# EAGLE design LDR-4 (EAGLE 7.2.0)
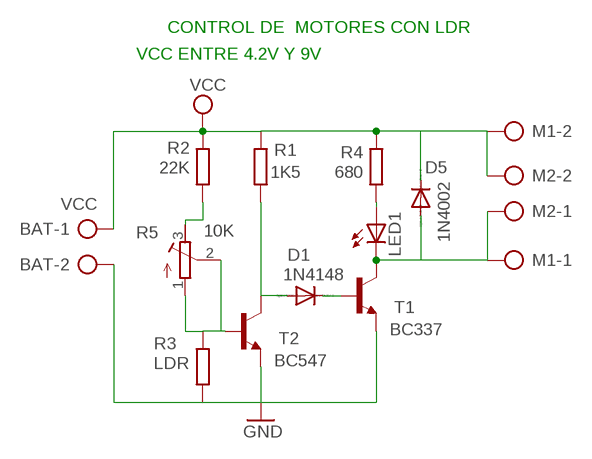
[diagram p0: schematic, sheet 1]

## Parts
BAT  VCC  AK500/2  [AK500/2]
D1  1N4148  1N4148DO35-7  [DO35-7]
D5  1N4002  1N4933  [DO41-10]
LED1  LED3MM  [LED3MM]
M1  AK500/2  [AK500/2]
M2  AK500/2  [AK500/2]
R1  1K5  R-EU_0207/7  [0207/7]
R2  22K  R-EU_0207/7  [0207/7]
R3  LDR  R-EU_0204/5  [0204/5]
R4  680  R-EU_0207/7  [0207/7]
R5  10K  R-TRIMM64W  [RTRIM64W]
T1  BC337  BC337-25-NPN-TO92-CBE  [TO92-CBE]
T2  BC547  BC547-NPN-TO92-CBE  [TO92-CBE]

## Nets
GND: BAT.2 R3.1 T1.E T2.E
N$1: D1.C T1.B
N$2: D1.A R1.1 T2.C
N$3: D5.A LED1.K(C) M1.1 M2.1 T1.C
N$4: R2.1 R5.3(E)
N$5: LED1.A R4.1
N$6: R3.2 R5.1(A) R5.2(S) T2.B
VCC: BAT.1 D5.C M1.2 M2.2 R1.2 R2.2 R4.2

## Notes on the sheet
- CONTROL DE  MOTORES CON LDR
- VCC ENTRE 4.2V Y 9V

## Library data of the parts
BAT M1 M2 = con-ptr500:AK500/2: CONNECTOR; OC_FARNELL: unknown; OC_NEWARK: unknown
D1 = diode:1N4148: DIODE high speed (Philips)
D5 = diode:1N4933: DIODE fast recovery rectifier, 1A
LED1 = led:LED: LED OSRAM: - CHIPLED LG R971, LG N971, LY N971, LG Q971, LY Q971, LO R971, LY R971 LH N974, LH R974 LS Q976, LO Q976, LY Q976 LO Q996 - Hyper CHIPLED LW Q18S LB Q993, LB Q99A, LB R99A - SideLED LS A670, LO A670, LY A670, LG A670, LP A670 LB A673, LV A673, LT A673, LW A673 LH A674 LY A675 LS A676, LA A676, LO A676, LY A676, LW A676 LS A679, LY A679, LG A679 - Hyper Micro SIDELED® LS Y876, LA Y876, LO Y876, LY Y876 LT Y87S - SmartLED LW L88C, LW L88S LB L89C, LB L89S, LG L890 LS L89K, LO L89K, LY L89K LS L896, LA L896, LO L896, LY L896 - TOPLED LS T670, LO T670, LY T670, LG T670, LP T670 LSG T670, LSP T670, LSY T670, LOP T670, LYG T670 LG T671, LOG T671, LSG T671 LB T673, LV T673, LT T673, LW T673 LH T674 LS T676, LA T676, LO T676, LY T676, LB T676, LH T676, LSB T676, LW T676 LB T67C, LV T67C, LT T67C, LS T67K, LO T67K, LY T67K, LW E67C LS E67B, LA E67B, LO E67B, LY E67B, LB E67C, LV E67C, LT E67C LW T67C LS T679, LY T679, LG T679 LS T770, LO T770, LY T770, LG T770, LP T770 LB T773, LV T773, LT T773, LW T773 LH T774 LS E675, LA E675, LY E675, LS T675 LS T776, LA T776, LO T776, LY T776, LB T776 LHGB T686 LT T68C, LB T68C - Hyper Mini TOPLED® LB M676 - Mini TOPLED Santana® LG M470 LS M47K, LO M47K, LY M47K Source: http://www.osram.convergy.de LUXEON: - LUMILED® LXK2-PW12-R00, LXK2-PW12-S00, LXK2-PW14-U00, LXK2-PW14-V00 LXK2-PM12-R00, LXK2-PM12-S00, LXK2-PM14-U00 LXK2-PE12-Q00, LXK2-PE12-R00, LXK2-PE12-S00, LXK2-PE14-T00, LXK2-PE14-U00 LXK2-PB12-K00, LXK2-PB12-L00, LXK2-PB12-M00, LXK2-PB14-N00, LXK2-PB14-P00, LXK2-PB14-Q00 LXK2-PR12-L00, LXK2-PR12-M00, LXK2-PR14-Q00, LXK2-PR14-R00 LXK2-PD12-Q00, LXK2-PD12-R00, LXK2-PD12-S00 LXK2-PH12-R00, LXK2-PH12-S00 LXK2-PL12-P00, LXK2-PL12-Q00, LXK2-PL12-R00 Source: www.luxeon.com KINGBRIGHT: KA-3528ASYC Source: www.kingbright.com
R1-R4 = resistor:R-EU_: RESISTOR, European symbol
R5 = rcl:R-TRIMM: Trimm resistor
T1 T2 = transistor:*-NPN-: NPN Transistror BF959 corrected 2008.03.06

## Board
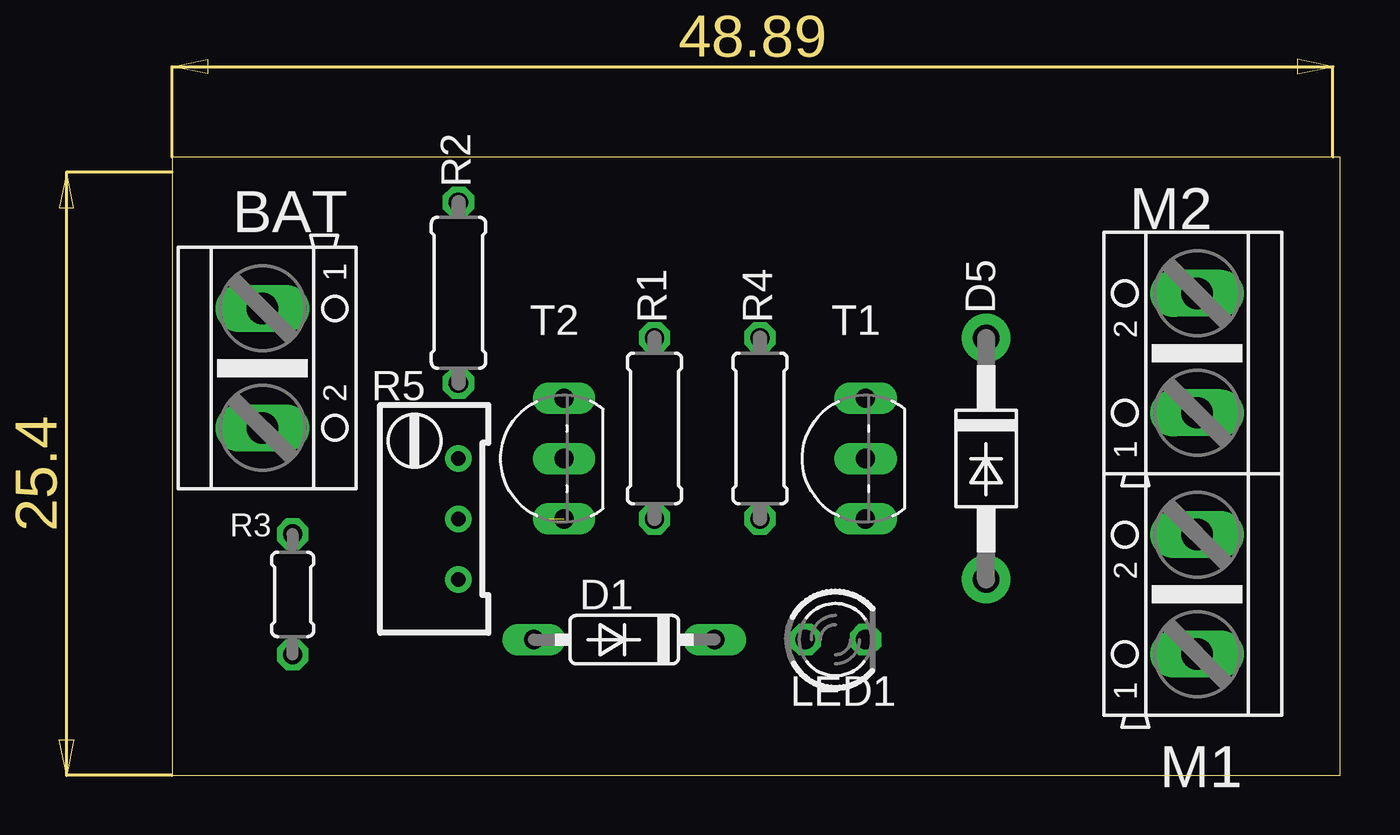
[diagram p1: board, top side]
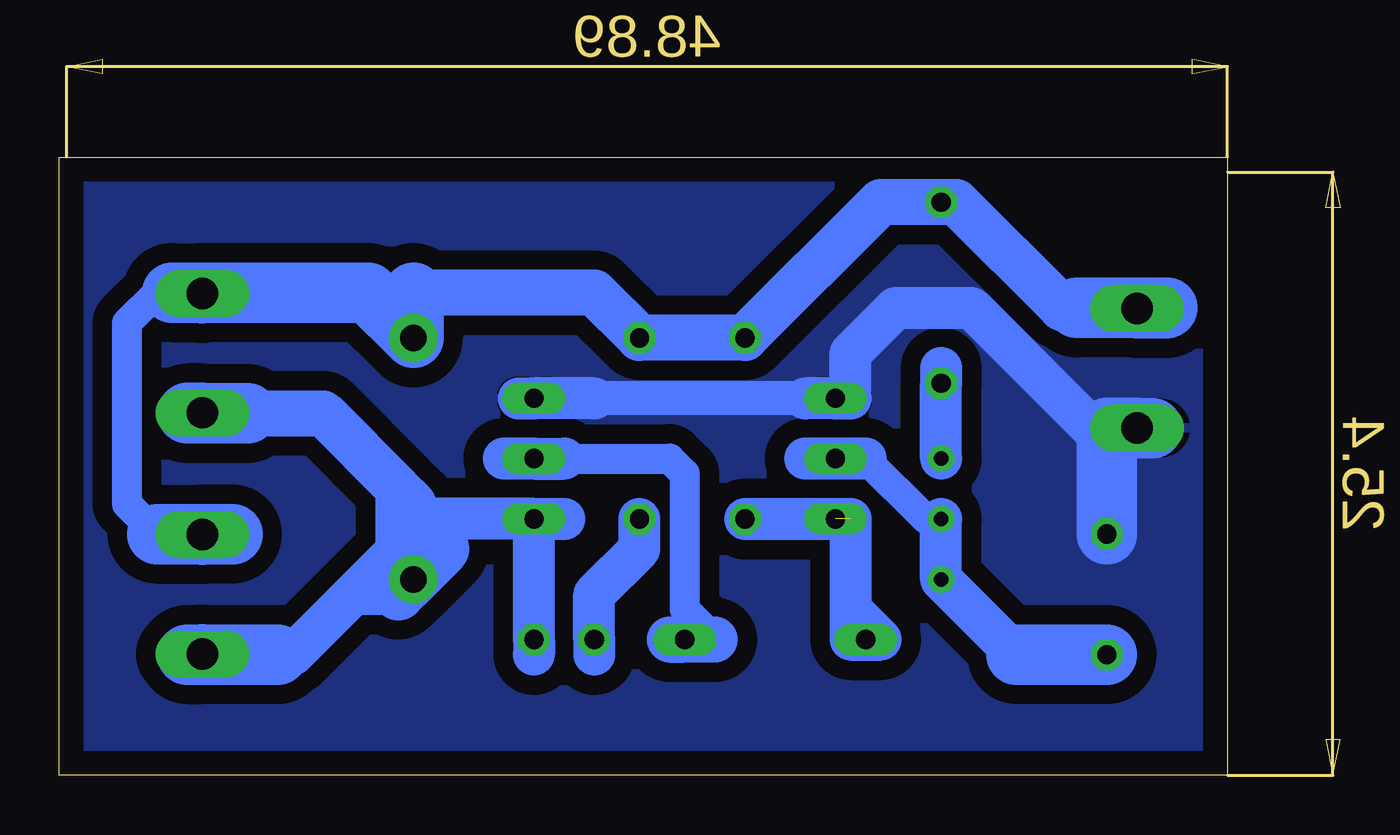
[diagram p2: board, bottom side, seen from below]

Size 49.2 x 26.02 mm. Coordinates in mm from the lower left corner, seen from the top.
Outline: 0,0 49.2,0 49.2,26.02 0,26.02 0,0
Copper layers (1*16): Top 0.035mm / dielectric 1.5mm / Bottom 0.035mm
Design rules "default": minimum track width 10mil, minimum drill 24mil, track to track 8mil, track to pad 8mil, pad to pad 8mil, via to via 8mil, smd to smd 8mil, copper to edge 40mil, drill to drill 8mil, minimum pad ring 10mil, minimum via ring 8mil, stop-mask expansion 4mil, vias tented up to drill 0mil, thermal gap 10mil

### Footprints (pad centres in the part's own frame; a part is rotated, then mirrored left to right if it is on the bottom)
AK500/2 = drill 1.321 long: 1 -2.515,0; 2 2.515,0
DO35-7 = drill 0.813 long: A 3.81,0; C -3.81,0
DO41-10 = drill 1.118 pad 2.032: A 5.08,0; C -5.08,0
LED3MM = drill 0.813 octagon: A -1.27,0; K 1.27,0
0207/7 = drill 0.813 octagon: 1 -3.81,0; 2 3.81,0
0204/5 = drill 0.813 octagon: 1 -2.54,0; 2 2.54,0
RTRIM64W = drill 0.61: 1 1.27,-2.54; 2 1.27,0; 3 1.27,2.54
TO92-CBE = drill 0.813 long: B 0,0; C -2.54,0; E 2.54,0

### Placement (x,y rotation side)
BAT  3.81,17.14 270 top
D1  19.05,5.71 180 top
D5  34.29,13.34 270 top
LED1  27.94,5.71 0 top
M1  43.18,7.62 90 top
M2  43.18,17.78 90 top
R1  20.32,14.61 90 top
R2  12.06,20.32 90 top
R3  5.08,7.62 270 top
R4  24.77,14.61 90 top
R5  10.79,10.8 0 top
T1  29.21,13.34 90 top
T2  16.51,13.34 90 top

### Tracks (layer width: path | path; a pad name or v marks a point on that pad's centre or on a via)
GND
  Bottom 1.422: 17.78,15.88 26.67,15.88
  Bottom 1.778: 17.78,15.88 T2.E 15.87,15.88 15.87,17.78 13.97,19.69 10.79,19.69 5.71,14.61 5.08,14.61 | 26.67,15.88 T1.E 29.85,15.88
  Bottom 2.54: 5.08,14.61 3.78,14.61 | 3.18,14.61 3.78,14.61 | 3.78,14.61 BAT.2 5.05,14.63 5.08,14.61 | 5.08,14.61 R3.1
  pour Bottom (isolate 0.813): -0.64,-1.27 48.89,-1.27 48.89,26.04 -0.64,26.04
N$1
  Bottom 1.27: 27.94,13.34 23.5,13.34 22.86,12.7 22.86,6.99 21.59,5.71
  Bottom 1.778: 30.48,13.34 T1.B 27.94,13.34
  Bottom 1.93: 21.59,5.71 D1.C 23.5,5.71
N$2  (1 unrouted)
  Bottom 1.778: R1.1 15.87,10.8 15.87,6.99 | 15.87,6.35 15.87,5.71 D1.A | D1.A 14.6,5.71 15.87,6.99 | 15.87,6.99 15.87,6.35 | 15.87,6.35 D1.A
N$3
  Bottom 1.778: T1.C 27.94,10.8 | T1.C 33.66,10.8 36.83,7.62 | 36.83,7.62 39.37,5.08 40,5.08 | 34.92,7.62 36.83,7.62 | 29.21,5.08 LED1.K T1.C
  Bottom 1.93: 41.27,15.24 38.1,15.24 34.92,12.07 | 34.29,11.43 34.92,12.07 | 34.92,12.07 34.92,7.62
  Bottom 2.184: 33.02,9.53 D5.A 34.92,7.62
  Bottom 2.54: 40,5.08 43.2,5.08 | 43.81,5.08 43.2,5.08 | 43.2,5.08 M1.1 | M2.1 43.79,15.27 43.81,15.24 41.27,15.24
N$4
  Bottom 1.778: R5.3 R2.1 12.06,17.14
N$5
  Bottom 1.778: 26.67,5.08 LED1.A 26.67,7.62 24.77,9.53 R4.1
N$6
  Bottom 1.27: R5.2 12.7,10.8 15.24,13.34
  Bottom 1.778: R5.2 R5.1 8.89,5.08 | 17.78,13.34 T2.B 15.24,13.34
  Bottom 2.54: R3.2 8.89,5.08
VCC
  Bottom 1.27: M2.2 44.42,20.3 44.45,20.32 45.09,20.32 46.35,19.05 46.35,11.43 45.09,10.16
  Bottom 1.93: 6.35,19.69 6.98,19.69 11.43,24.13 R2.2 14.6,24.13 R1.2 R4.2 26.67,20.32 34.29,20.32
  Bottom 2.54: BAT.1 2.56,19.66 2.54,19.69 6.35,19.69 | 34.29,20.32 D5.C 36.2,20.32 43.2,20.32 | 44.45,20.32 43.2,20.32 | 43.2,20.32 M2.2 | 45.09,10.16 43.16,10.16 | 41.91,10.16 43.16,10.16 | 43.16,10.16 M1.2